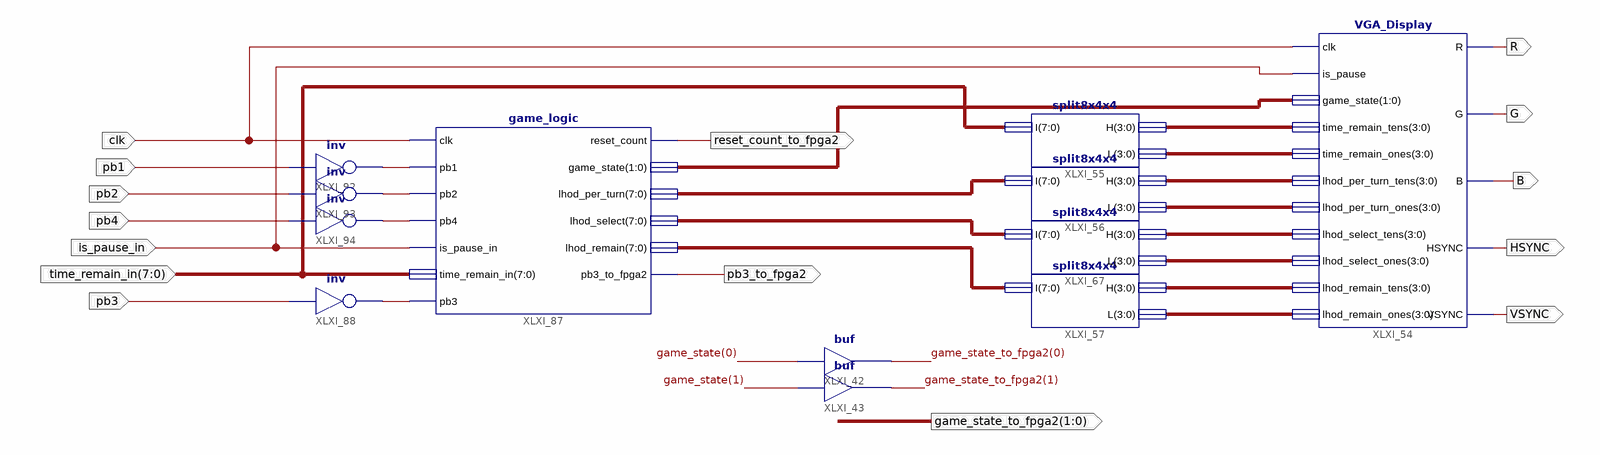
[diagram p0: schematic sheet 1]
// Xilinx ISE schematic main.sch (spartan6) as structural Verilog: 12 symbols, 15 ports
module main (
  input  pb1,
  input  pb2,
  input  is_pause_in,
  input  [7:0] time_remain_in,
  input  clk,
  input  pb4,
  input  pb3,
  output pb3_to_fpga2,
  output R,
  output G,
  output B,
  output VSYNC,
  output HSYNC,
  output reset_count_to_fpga2,
  output [1:0] game_state_to_fpga2
);

  wire XLXN_359, XLXN_360, XLXN_361, XLXN_362;
  wire [1:0] game_state;
  wire [3:0] XLXN_291, XLXN_292, XLXN_293, XLXN_294, XLXN_295, XLXN_296, XLXN_297, XLXN_298;
  wire [7:0] XLXN_347, XLXN_348, XLXN_349;

  split8x4x4 XLXI_55 (.H(XLXN_291), .I(time_remain_in), .L(XLXN_292));
  split8x4x4 XLXI_56 (.H(XLXN_293), .I(XLXN_347), .L(XLXN_294));
  split8x4x4 XLXI_57 (.H(XLXN_297), .I(XLXN_349), .L(XLXN_298));
  split8x4x4 XLXI_67 (.H(XLXN_295), .I(XLXN_348), .L(XLXN_296));
  VGA_Display XLXI_54 (
    .clk(clk), .is_pause(is_pause_in), .game_state(game_state), .time_remain_tens(XLXN_291),
    .time_remain_ones(XLXN_292), .lhod_per_turn_tens(XLXN_293), .lhod_per_turn_ones(XLXN_294),
    .lhod_select_tens(XLXN_295), .lhod_select_ones(XLXN_296), .lhod_remain_tens(XLXN_297),
    .lhod_remain_ones(XLXN_298), .R(R), .G(G), .B(B), .HSYNC(HSYNC), .VSYNC(VSYNC));
  buf XLXI_42 (game_state_to_fpga2[0], game_state[0]);
  buf XLXI_43 (game_state_to_fpga2[1], game_state[1]);
  not XLXI_88 (XLXN_362, pb3);
  game_logic XLXI_87 (
    .clk(clk), .game_state(game_state), .is_pause_in(is_pause_in), .lhod_per_turn(XLXN_347),
    .lhod_remain(XLXN_349), .lhod_select(XLXN_348), .pb1(XLXN_361), .pb2(XLXN_360), .pb3(XLXN_362),
    .pb3_to_fpga2(pb3_to_fpga2), .pb4(XLXN_359), .reset_count(reset_count_to_fpga2),
    .time_remain_in(time_remain_in));
  not XLXI_92 (XLXN_361, pb1);
  not XLXI_93 (XLXN_360, pb2);
  not XLXI_94 (XLXN_359, pb4);
endmodule
